# EAGLE schematic Control_Unit_Schematic (EAGLE 6.4)
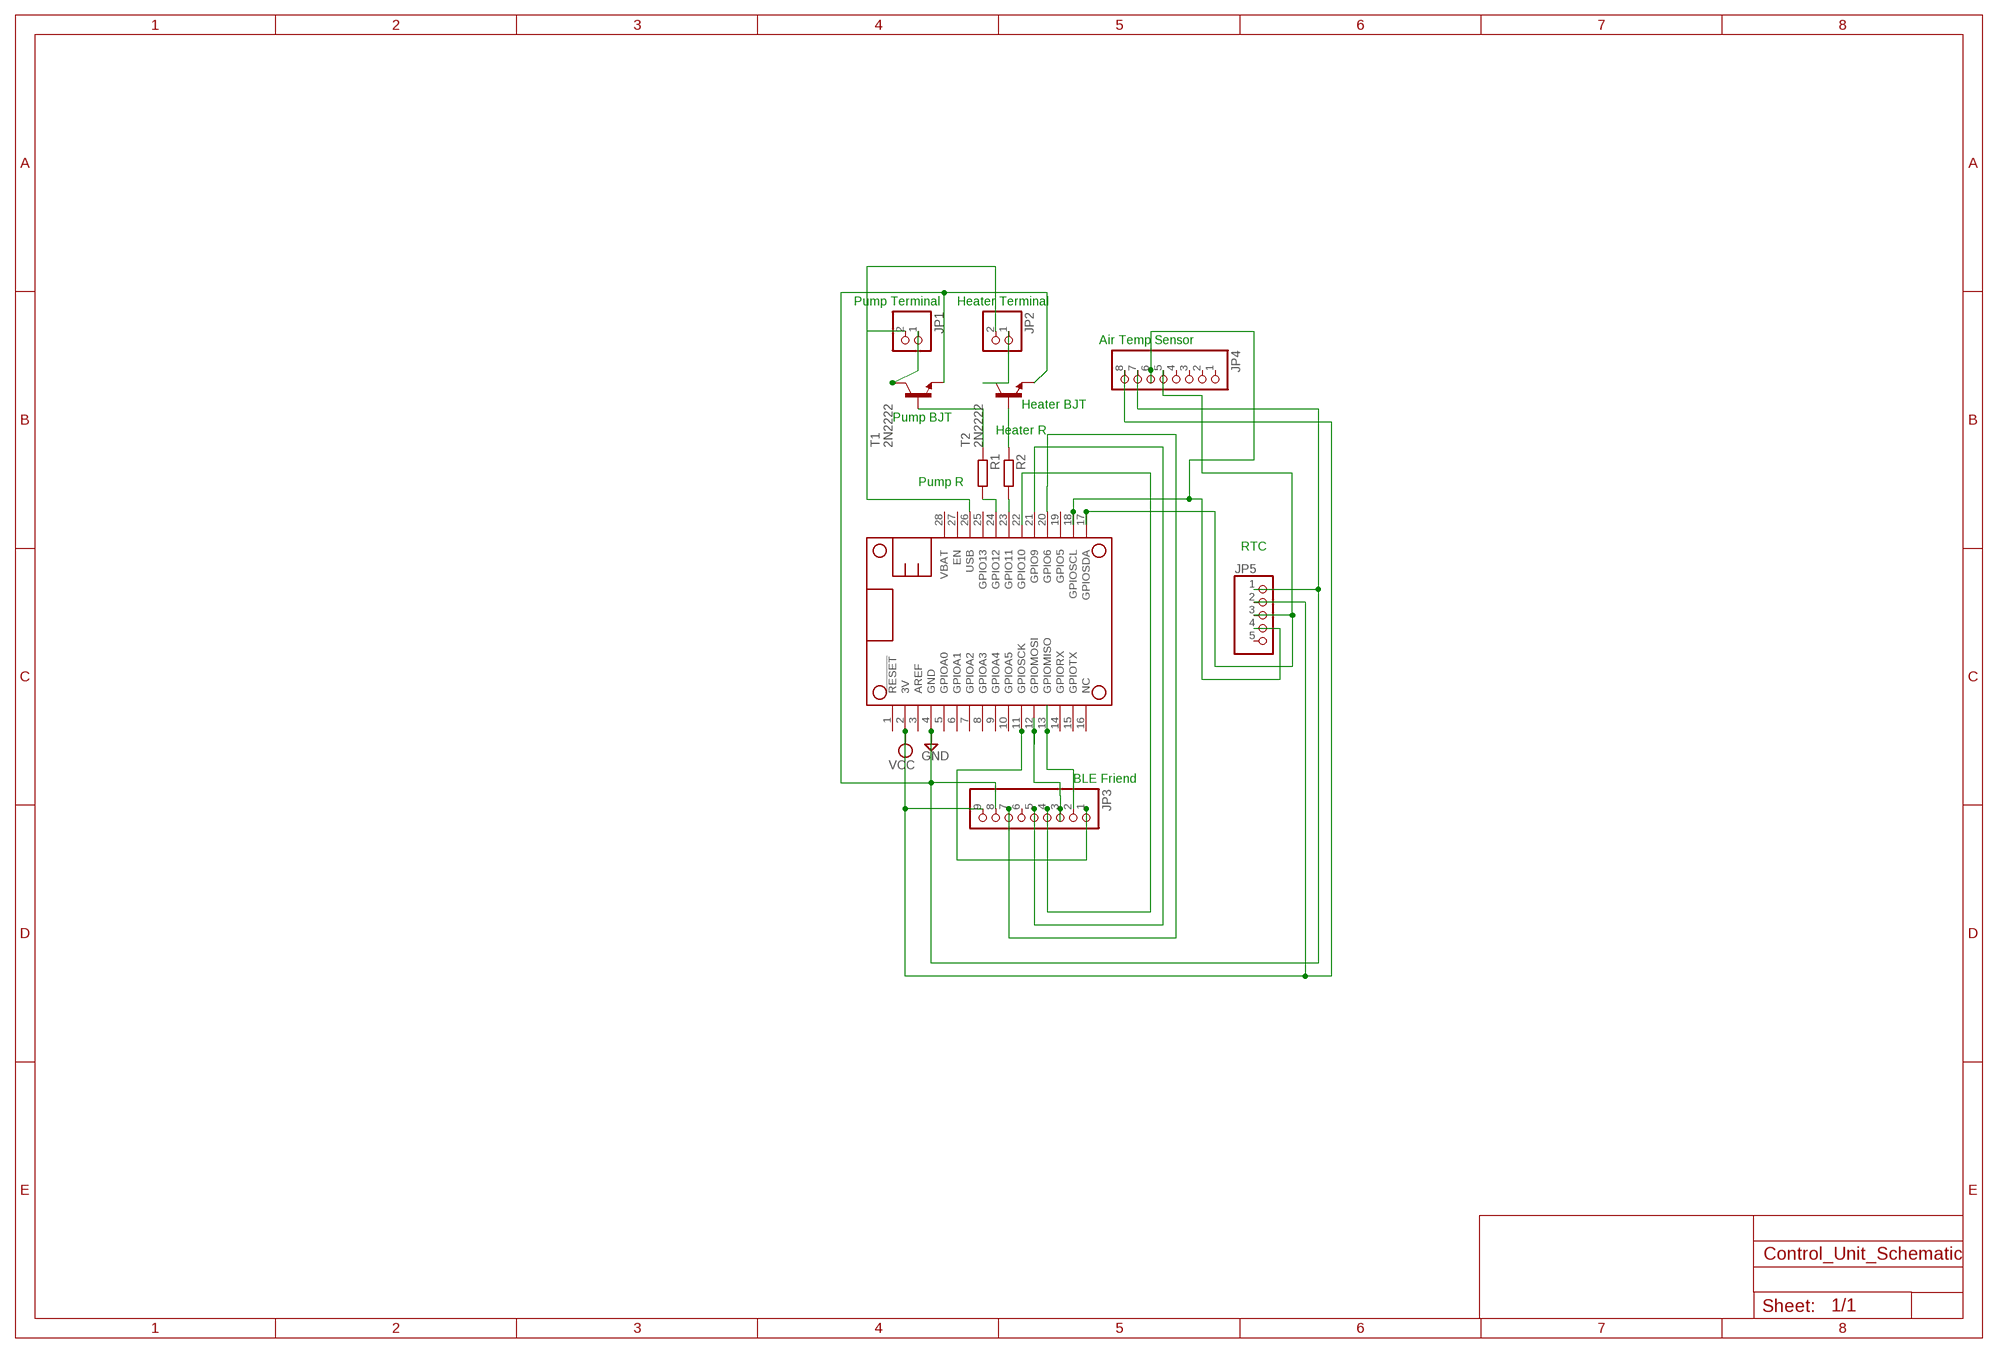
[diagram p0: schematic, sheet 1]

## Parts
JP1  PINHD-1X2  [1X02]
JP2  PINHD-1X2  [1X02]
JP3  PINHD-1X9  [1X09]
JP4  PINHD-1X8  [1X08]
JP5  PINHD-1X5  [1X05]
MS1  FEATHERWING_NODIM  [FEATHERWING_DIM]
R1  R0207/10  [0207/10]
R2  R0207/10  [0207/10]
T1  2N2222  [TO92-EBC-OVAL]
T2  2N2222  [TO92-EBC-OVAL]

## Nets
GND: JP3.8 JP4.7 JP5.1 MS1.4(GND) T1.E T2.E
N$1: JP3.2 MS1.13(GPIOMISO)
N$2: JP3.3 MS1.12(GPIOMOSI)
N$3: JP3.1 MS1.11(GPIOSCK)
N$4: JP3.4
N$5: JP3.5 MS1.21(GPIO9)
N$6: MS1.23(GPIO11) R2.2
N$7: MS1.24(GPIO12) R1.2
N$8: R1.1 T1.B
N$9: R2.1 T2.B
N$10: JP4.5 JP5.3 MS1.17(GPIOSDA)
N$11: JP1.1 T1.C
N$12: JP2.1 T2.C
N$14: JP4.6 JP5.4 MS1.18(GPIOSCL)
N$15: JP3.7 MS1.20(GPIO6)
USB: JP1.2 JP2.2 MS1.26(USB)
VCC: JP3.9 JP4.8 JP5.2 MS1.2(3V)
Unconnected: JP3.6 JP4.1 JP4.2 JP4.3 JP4.4 JP5.5 MS1.1(!RESET) MS1.3(AREF) MS1.5(GPIOA0) MS1.6(GPIOA1) MS1.7(GPIOA2) MS1.8(GPIOA3) MS1.9(GPIOA4) MS1.10(GPIOA5) MS1.14(GPIORX) MS1.15(GPIOTX) MS1.16(NC) MS1.19(GPIO5) MS1.22(GPIO10) MS1.25(GPIO13) MS1.27(EN) MS1.28(VBAT)

## Notes on the sheet
- Pump Terminal | Heater Terminal
- Air Temp Sensor
- Heater BJT
- Pump BJT
- Heater R
- Pump R
- RTC
- BLE Friend

## Library data of the parts
JP1 JP2 = pinhead:PINHD-1X2: PIN HEADER
JP3 = pinhead:PINHD-1X9: PIN HEADER
JP4 = pinhead:PINHD-1X8: PIN HEADER
JP5 = pinhead:PINHD-1X5: PIN HEADER
MS1 = adafruit:FEATHERWING
R1 R2 = eagle-ltspice:R: RESISTOR, European symbol; SPICEMODEL: NONE; SPICEPREFIX: R
T1 T2 = adafruit:2N2222: NPN TRANSISTOR Big oval pads

## Net classes
0 default: width 0.406 mm